# EAGLE design ArduinoInterface_v3 (EAGLE 9.2.1)
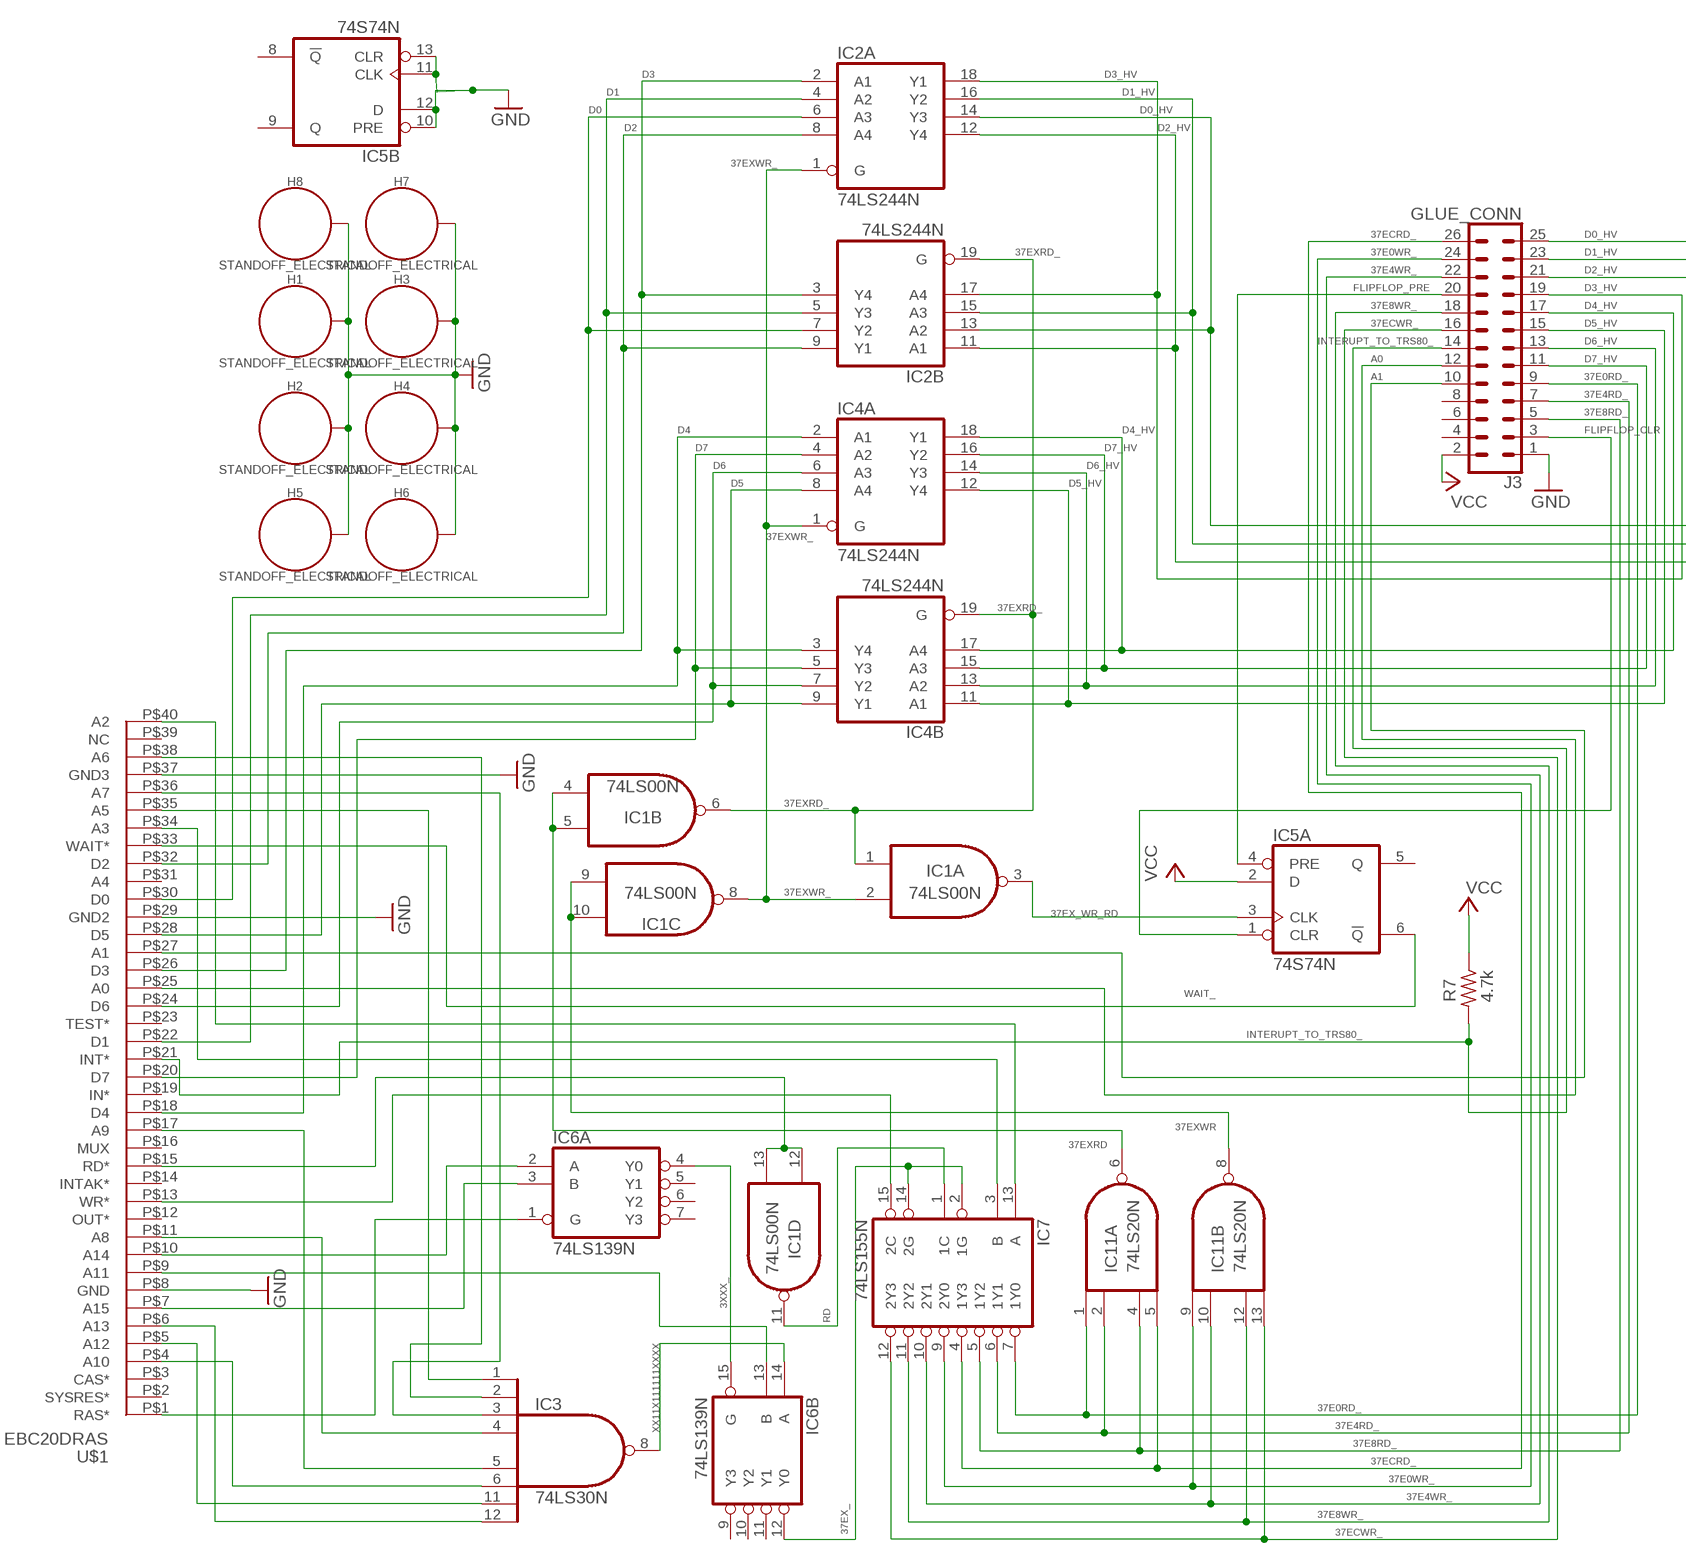
[diagram p0: schematic, sheet 1, part 1 of 2]
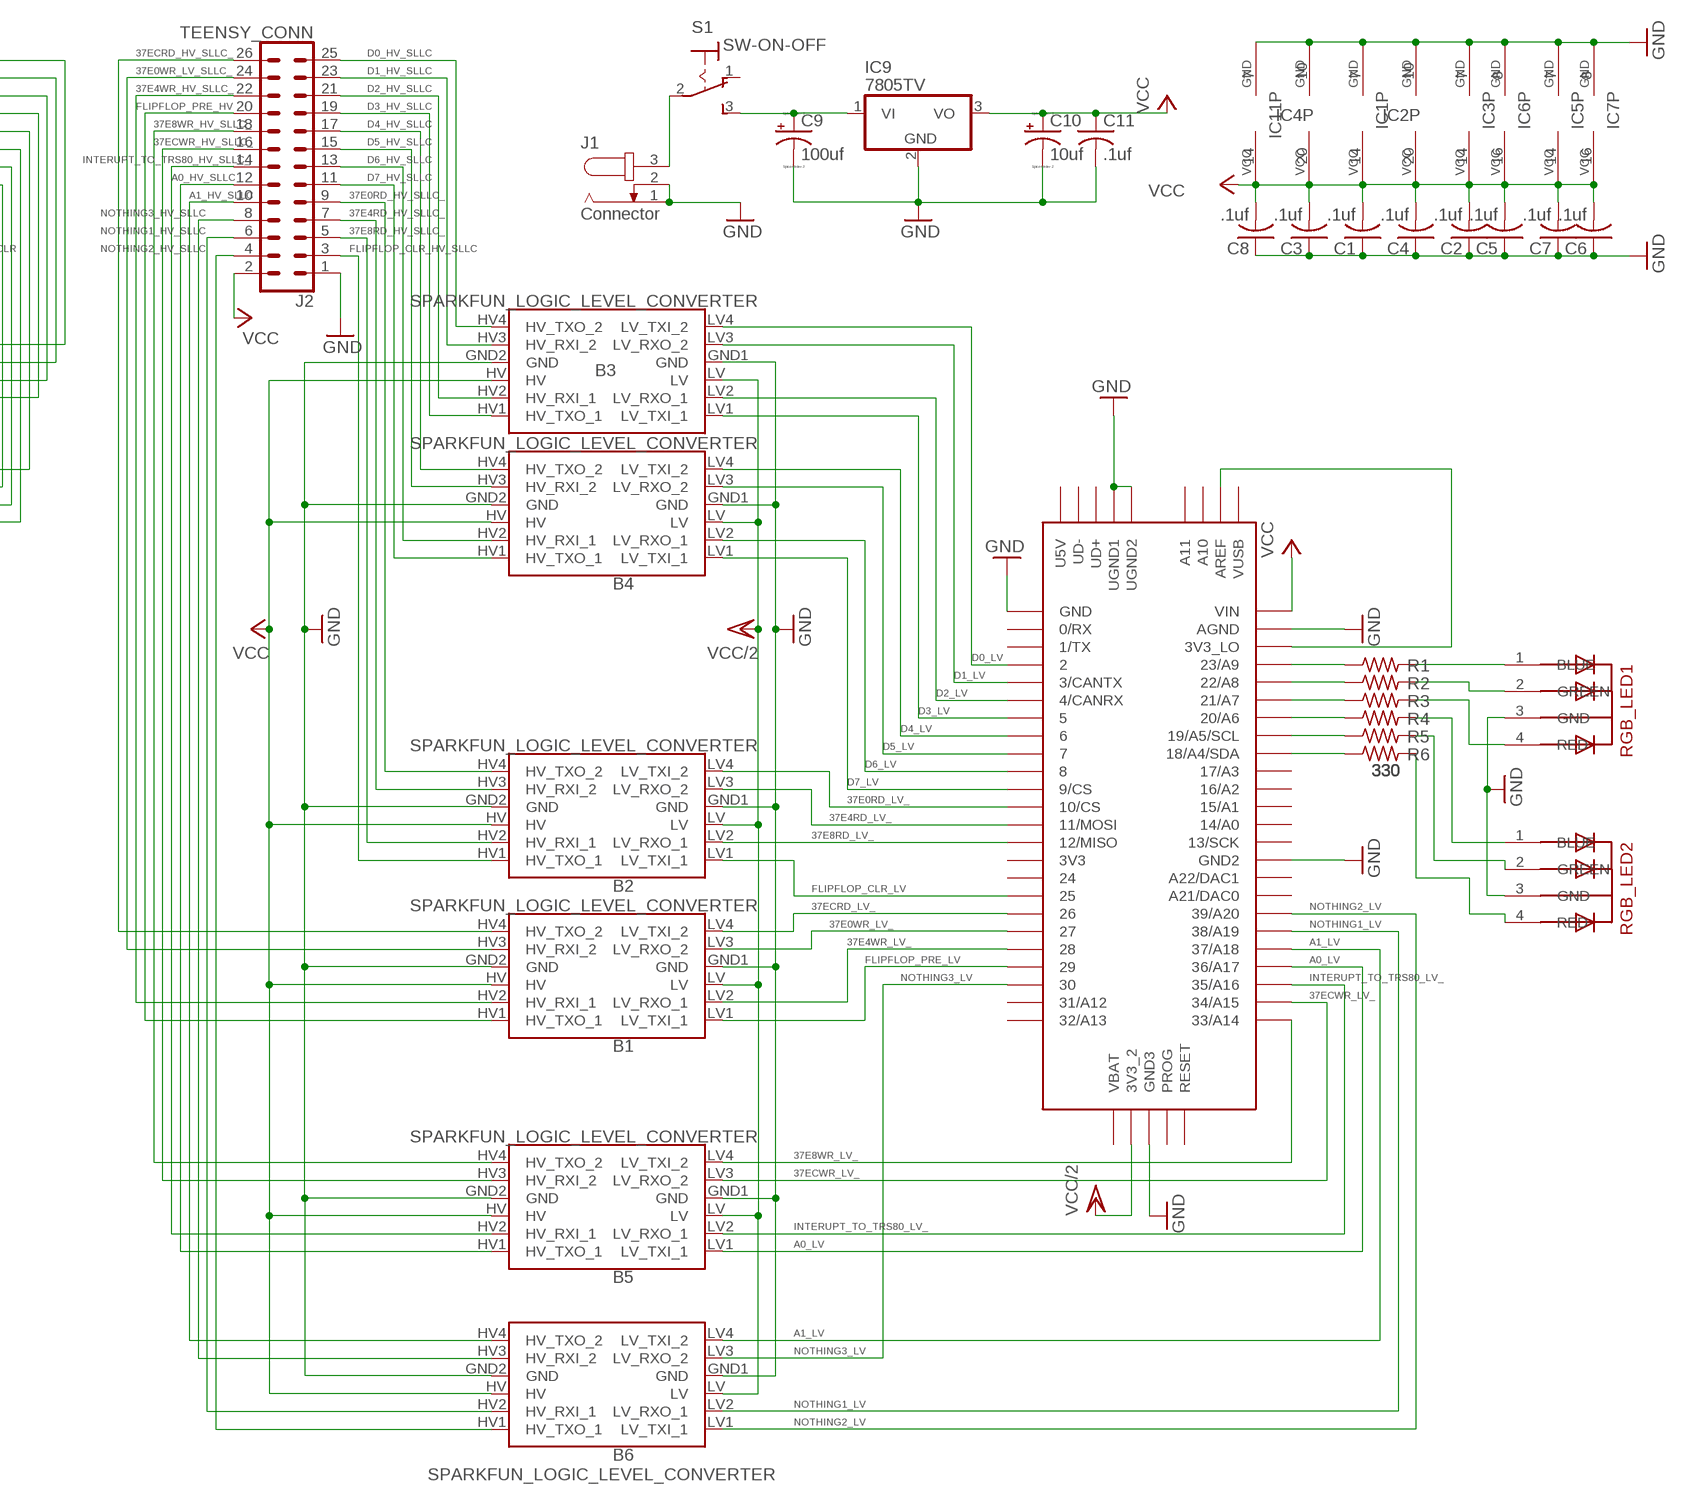
[diagram p1: schematic, sheet 1, part 2 of 2]

## Parts
B1  SPARKFUN_LOGIC_LEVEL_CONVERTER  [SPARKFUN_LOGIC_LEVEL_CONVERTER]
B2  SPARKFUN_LOGIC_LEVEL_CONVERTER  [SPARKFUN_LOGIC_LEVEL_CONVERTER]
B3  SPARKFUN_LOGIC_LEVEL_CONVERTER  [SPARKFUN_LOGIC_LEVEL_CONVERTER]
B4  SPARKFUN_LOGIC_LEVEL_CONVERTER  [SPARKFUN_LOGIC_LEVEL_CONVERTER]
B5  SPARKFUN_LOGIC_LEVEL_CONVERTER  [SPARKFUN_LOGIC_LEVEL_CONVERTER]
B6  SPARKFUN_LOGIC_LEVEL_CONVERTER  [SPARKFUN_LOGIC_LEVEL_CONVERTER]
C1  .1uf  C-US025-025X050  [C025-025X050]
C2  .1uf  C-US025-025X050  [C025-025X050]
C3  .1uf  C-US025-025X050  [C025-025X050]
C4  .1uf  C-US025-025X050  [C025-025X050]
C5  .1uf  C-US025-025X050  [C025-025X050]
C6  .1uf  C-US025-025X050  [C025-025X050]
C7  .1uf  C-US025-025X050  [C025-025X050]
C8  .1uf  C-US025-025X050  [C025-025X050]
C9  100uf  CPOL-USE5-6  [E5-6]
C10  10uf  CPOL-USE5-6  [E5-6]
C11  .1uf  C-US025-025X050  [C025-025X050]
H1  STANDOFF_ELECTRICAL  [STANDOFF-ELECTRICAL]
H2  STANDOFF_ELECTRICAL  [STANDOFF-ELECTRICAL]
H3  STANDOFF_ELECTRICAL  [STANDOFF-ELECTRICAL]
H4  STANDOFF_ELECTRICAL  [STANDOFF-ELECTRICAL]
H5  STANDOFF_ELECTRICAL  [STANDOFF-ELECTRICAL]
H6  STANDOFF_ELECTRICAL  [STANDOFF-ELECTRICAL]
H7  STANDOFF_ELECTRICAL  [STANDOFF-ELECTRICAL]
H8  STANDOFF_ELECTRICAL  [STANDOFF-ELECTRICAL]
IC1  74LS00N  [DIL14]
IC2  74LS244N  [DIL20]
IC3  74LS30N  [DIL14]
IC4  74LS244N  [DIL20]
IC5  74S74N  [DIL14]
IC6  74LS139N  [DIL16]
IC7  74LS155N  [DIL16]
IC9  7805TV  [TO220V]
IC11  74LS20N  [DIL14]
J1  Connector  JACK-PLUG0  [SPC4077]
J2  TEENSY_CONN  CONN_13X22X13  [2X13]
J3  GLUE_CONN  CONN_13X22X13  [2X13]
R1  330  R-US_0204/2V  [0204V]
R2  330  R-US_0204/2V  [0204V]
R3  330  R-US_0204/2V  [0204V]
R4  330  R-US_0204/2V  [0204V]
R5  330  R-US_0204/2V  [0204V]
R6  330  R-US_0204/2V  [0204V]
R7  4.7k  R-US_0204/2V  [0204V]
RGB_LED1  5MMRGBLED  [LED5MMRGB]
RGB_LED2  5MMRGBLED  [LED5MMRGB]
S1  SW-ON-OFF  M9040P  [M9040P]
U$1  EBC20DRAS  [EBC20DRAS]
U$2  TEENSY_3.5/3.6  [TEENSY_3.5/3.6]

## Nets
3XXX_: IC6.4(A:Y0) IC6.15(B:G)
9V: C9.+ IC9.1(VI) S1.3(S)
9V_TO_SW: J1.3 S1.2(P)
37E0RD_: IC7.7(1Y0) IC11.1(A:I0) J3.9
37E0RD_HV_SLLC_: B2.HV4(HV_TXO_2) J2.9
37E0RD_LV_: B2.LV4(LV_TXI_2) U$2.10/CS
37E0WR_: IC7.9(2Y0) IC11.9(B:I0) J3.24
37E0WR_LV_: B1.LV3(LV_RXO_2) U$2.27
37E0WR_LV_SLLC_: B1.HV3(HV_RXI_2) J2.24
37E4RD_: IC7.6(1Y1) IC11.2(A:I1) J3.7
37E4RD_HV_SLLC_: B2.HV3(HV_RXI_2) J2.7
37E4RD_LV_: B2.LV3(LV_RXO_2) U$2.11/MOSI
37E4WR_: IC7.10(2Y1) IC11.10(B:I1) J3.22
37E4WR_HV_SLLC_: B1.HV2(HV_RXI_1) J2.22
37E4WR_LV_: B1.LV2(LV_RXO_1) U$2.28
37E8RD_: IC7.5(1Y2) IC11.4(A:I2) J3.5
37E8RD_HV_SLLC_: B2.HV2(HV_RXI_1) J2.5
37E8RD_LV_: B2.LV2(LV_RXO_1) U$2.12/MISO
37E8WR_: IC7.11(2Y2) IC11.12(B:I2) J3.18
37E8WR_HV_SLLC_: B5.HV4(HV_TXO_2) J2.18
37E8WR_LV_: B5.LV4(LV_TXI_2) U$2.33/A14
37ECRD_: IC7.4(1Y3) IC11.5(A:I3) J3.26
37ECRD_HV_SLLC_: B1.HV4(HV_TXO_2) J2.26
37ECRD_LV_: B1.LV4(LV_TXI_2) U$2.26
37ECWR_: IC7.12(2Y3) IC11.13(B:I3) J3.16
37ECWR_HV_SLLC_: B5.HV3(HV_RXI_2) J2.16
37ECWR_LV_: B5.LV3(LV_RXO_2) U$2.34/A15
37EX_: IC6.12(B:Y0) IC7.2(1G) IC7.14(2G)
37EX_WR_RD: IC1.3(A:O) IC5.3(A:CLK)
37EXRD: IC1.4(B:I0) IC1.5(B:I1) IC11.6(A:O)
37EXRD_: IC1.1(A:I0) IC1.6(B:O) IC2.19(B:G) IC4.19(B:G)
37EXWR: IC1.9(C:I0) IC1.10(C:I1) IC11.8(B:O)
37EXWR_: IC1.2(A:I1) IC1.8(C:O) IC2.1(A:G) IC4.1(A:G)
A0: J3.12 U$1.P$25(A0)
A0_HV_SLLC: B5.HV1(HV_TXO_1) J2.12
A0_LV: B5.LV1(LV_TXI_1) U$2.36/A17
A1: J3.10 U$1.P$27(A1)
A1_HV_SLLC: B6.HV4(HV_TXO_2) J2.10
A1_LV: B6.LV4(LV_TXI_2) U$2.37/A18
A2: IC7.13(A) U$1.P$40(A2)
A3: IC7.3(B) U$1.P$34(A3)
A5: IC3.1(I0) U$1.P$35(A5)
A6: IC3.2(I1) U$1.P$38(A6)
A7: IC3.3(I2) U$1.P$36(A7)
A8: IC3.4(I3) U$1.P$11(A8)
A9: IC3.5(I4) U$1.P$17(A9)
A10: IC3.6(I5) U$1.P$4(A10)
A11: IC6.13(B:B) U$1.P$9(A11)
A12: IC3.11(I6) U$1.P$5(A12)
A13: IC3.12(I7) U$1.P$6(A13)
A14: IC6.2(A:A) U$1.P$10(A14)
A15: IC6.3(A:B) U$1.P$7(A15)
D0: IC2.6(A:A3) IC2.7(B:Y2) U$1.P$30(D0)
D0_HV: IC2.13(B:A2) IC2.14(A:Y3) J3.25
D0_HV_SLLC: B3.HV4(HV_TXO_2) J2.25
D0_LV: B3.LV4(LV_TXI_2) U$2.2
D1: IC2.4(A:A2) IC2.5(B:Y3) U$1.P$22(D1)
D1_HV: IC2.15(B:A3) IC2.16(A:Y2) J3.23
D1_HV_SLLC: B3.HV3(HV_RXI_2) J2.23
D1_LV: B3.LV3(LV_RXO_2) U$2.3/CANTX
D2: IC2.8(A:A4) IC2.9(B:Y1) U$1.P$32(D2)
D2_HV: IC2.11(B:A1) IC2.12(A:Y4) J3.21
D2_HV_SLLC: B3.HV2(HV_RXI_1) J2.21
D2_LV: B3.LV2(LV_RXO_1) U$2.4/CANRX
D3: IC2.2(A:A1) IC2.3(B:Y4) U$1.P$26(D3)
D3_HV: IC2.17(B:A4) IC2.18(A:Y1) J3.19
D3_HV_SLLC: B3.HV1(HV_TXO_1) J2.19
D3_LV: B3.LV1(LV_TXI_1) U$2.5
D4: IC4.2(A:A1) IC4.3(B:Y4) U$1.P$18(D4)
D4_HV: IC4.17(B:A4) IC4.18(A:Y1) J3.17
D4_HV_SLLC: B4.HV4(HV_TXO_2) J2.17
D4_LV: B4.LV4(LV_TXI_2) U$2.6
D5: IC4.8(A:A4) IC4.9(B:Y1) U$1.P$28(D5)
D5_HV: IC4.11(B:A1) IC4.12(A:Y4) J3.15
D5_HV_SLLC: B4.HV3(HV_RXI_2) J2.15
D5_LV: B4.LV3(LV_RXO_2) U$2.7
D6: IC4.6(A:A3) IC4.7(B:Y2) U$1.P$24(D6)
D6_HV: IC4.13(B:A2) IC4.14(A:Y3) J3.13
D6_HV_SLLC: B4.HV2(HV_RXI_1) J2.13
D6_LV: B4.LV2(LV_RXO_1) U$2.8
D7: IC4.4(A:A2) IC4.5(B:Y3) U$1.P$20(D7)
D7_HV: IC4.15(B:A3) IC4.16(A:Y2) J3.11
D7_HV_SLLC: B4.HV1(HV_TXO_1) J2.11
D7_LV: B4.LV1(LV_TXI_1) U$2.9/CS
FLIPFLOP_CLR: IC5.1(A:CLR) J3.3
FLIPFLOP_CLR_HV_SLLC: B2.HV1(HV_TXO_1) J2.3
FLIPFLOP_CLR_LV: B2.LV1(LV_TXI_1) U$2.25
FLIPFLOP_PRE: IC5.4(A:PRE) J3.20
FLIPFLOP_PRE_HV: B1.HV1(HV_TXO_1) J2.20
FLIPFLOP_PRE_LV: B1.LV1(LV_TXI_1) U$2.29
GND: B1.GND1(GND) B1.GND2(GND) B2.GND1(GND) B2.GND2(GND) B3.GND1(GND) B3.GND2(GND) B4.GND1(GND) B4.GND2(GND) B5.GND1(GND) B5.GND2(GND) B6.GND1(GND) B6.GND2(GND) C1.1 C2.1 C3.1 C4.1 C5.1 C6.1 C7.1 C8.1 C9.- C10.- C11.2 H1.P1 H2.P1 H3.P1 H4.P1 H5.P1 H6.P1 H7.P1 H8.P1 IC1.7(P:GND) IC2.10(P:GND) IC3.7(GND) IC4.10(P:GND) IC5.7(P:GND) IC5.10(B:PRE) IC5.11(B:CLK) IC5.12(B:D) IC5.13(B:CLR) IC6.8(P:GND) IC7.8(GND) IC9.2(GND) IC11.7(P:GND) J1.1 J1.2 J2.1 J3.1 RGB_LED1.3(GND) RGB_LED2.3(GND) U$1.P$8(GND) U$1.P$29(GND2) U$1.P$37(GND3) U$2.AGND U$2.GND U$2.GND2 U$2.GND3 U$2.UGND1 U$2.UGND2
INTERUPT_TO_TRS80_: J3.14 R7.2 U$1.P$21(INT*)
INTERUPT_TO_TRS80_HV_SLLC_: B5.HV2(HV_RXI_1) J2.14
INTERUPT_TO_TRS80_LV_: B5.LV2(LV_RXO_1) U$2.35/A16
N$1: U$2.3V3_LO U$2.AREF
N$5: R1.1 U$2.23/A9
N$6: R2.1 U$2.22/A8
N$9: R3.1 U$2.21/A7
N$10: R1.2 RGB_LED1.1(BLUE)
N$14: R2.2 RGB_LED1.2(GREEN)
N$15: R3.2 RGB_LED1.4(RED)
N$16: R4.1 U$2.20/A6
N$17: R5.1 U$2.19/A5/SCL
N$18: R6.1 U$2.18/A4/SDA
N$19: R4.2 RGB_LED2.1(BLUE)
N$20: R5.2 RGB_LED2.2(GREEN)
N$21: R6.2 RGB_LED2.4(RED)
NOTHING1_HV_SLLC: B6.HV2(HV_RXI_1) J2.6
NOTHING1_LV: B6.LV2(LV_RXO_1) U$2.38/A19
NOTHING2_HV_SLLC: B6.HV1(HV_TXO_1) J2.4
NOTHING2_LV: B6.LV1(LV_TXI_1) U$2.39/A20
NOTHING3_HV_SLLC: B6.HV3(HV_RXI_2) J2.8
NOTHING3_LV: B6.LV3(LV_RXO_2) U$2.30
RAS_: IC6.1(A:G) U$1.P$1(RAS*)
RD: IC1.11(D:O) IC7.1(1C)
RD_: IC1.12(D:I0) IC1.13(D:I1) U$1.P$15(RD*)
VCC: B1.HV B2.HV B3.HV B4.HV B5.HV B6.HV C1.2 C2.2 C3.2 C4.2 C5.2 C6.2 C7.2 C8.2 C10.+ C11.1 IC1.14(P:VCC) IC2.20(P:VCC) IC3.14(VCC) IC4.20(P:VCC) IC5.2(A:D) IC5.14(P:VCC) IC6.16(P:VCC) IC7.16(VCC) IC9.3(VO) IC11.14(P:VCC) J2.2 J3.2 R7.1 U$2.VIN
VCC/2: B1.LV B2.LV B3.LV B4.LV B5.LV B6.LV U$2.3V3_2
WAIT_: IC5.6(A:!Q) U$1.P$33(WAIT*)
WR_: IC7.15(2C) U$1.P$13(WR*)
XX11X111111XXXX: IC3.8(O) IC6.14(B:A)
Unconnected: IC5.5(A:Q) IC5.8(B:!Q) IC5.9(B:Q) IC6.5(A:Y1) IC6.6(A:Y2) IC6.7(A:Y3) IC6.9(B:Y3) IC6.10(B:Y2) IC6.11(B:Y1) J3.4 J3.6 J3.8 S1.1(O) U$1.P$2(SYSRES*) U$1.P$3(CAS*) U$1.P$12(OUT*) U$1.P$14(INTAK*) U$1.P$16(MUX) U$1.P$19(IN*) U$1.P$23(TEST*) U$1.P$31(A4) U$1.P$39(NC) U$2.0/RX U$2.1/TX U$2.3V3 U$2.13/SCK U$2.14/A0 U$2.15/A1 U$2.16/A2 U$2.17/A3 U$2.21/DAC0(A21/DAC0) U$2.24 U$2.31/A12 U$2.32/A13 U$2.A10 U$2.A11 U$2.A22/DAC1 U$2.PROG U$2.RESET U$2.U5V U$2.UD+ U$2.UD- U$2.VBAT U$2.VUSB

## Library data of the parts
B1-B6 = SparkFun-Boards:SPARKFUN_LOGIC_LEVEL_CONVERTER: SparkFun Logic Level Converter -Bi-Directional This is the mechnical outline for the 3.3V - 5V bi directional logic level converter. *Note, the "LOCK" Package has the header pins staggered by an offset of 5 mils (off center line), so that when you slide a row of standard 0.1" headers into the PTH pads, it will hold position vertically. See the follwing turorial for more information on this type of special footprints: Sneaky Footprints <https://www.sparkfun.com/tutorials/114> SparkFun Products: SparkFun Logic Level Converter - Bi-Directional <https://www.sparkfun.com/products/12009>
C1-C8 C11 = adafruit:C-US: CAPACITOR, American symbol
C9 C10 = resistor:CPOL-US: POLARIZED CAPACITOR, American symbol
H1-H8 = SparkFun-Hardware:STANDOFF_ELECTRICAL: Stand Off Drill holes with an electrical connection. For example, use these to ground your board to a chassis. Example SparkFun Products Screw - Phillips Head (1/4", 4-40, 10 pack) <https://www.sparkfun.com/products/10453> (PRT-10453) Screw - Phillips Head (1/2", 4-40, 10 pack) <https://www.sparkfun.com/products/10452> (PRT-10452) Screw - Phillips Head (3/4", 4-40, 10 pack) <https://www.sparkfun.com/products/10451> (PRT-10451) Screw - Phillips Head (1", 4-40, 10 pack) <https://www.sparkfun.com/products/10450> (PRT-10450)
IC1 = 74xx-us:74*00: Quad 2-input NAND gate
IC2 IC4 = 74xx-us:74*244: Octal BUFFER and LINE DRIVER, 3-state
IC3 = 74xx-us:74*30: 8-input NAND gate
IC5 = 74xx-us:74*74: Dual D type positive edge triggered FLIP FLOP, preset and clear
IC6 = 74xx-us:74*139: Dual 2-line to 4-line DECODER/DEMULTIPLEXER
IC7 = 74xx-us:74*155: Dual 2-line to 4-line data DECODER/DEMULTIPLEXER
IC9 = linear:78*: Positive VOLTAGE REGULATOR Source: http://cache.national.com/ds/LM/LM78L05.pdf http://www.fairchildsemi.com/ds/LM/LM7805.pdf
IC11 = 74xx-us:74*20: Dual 4-input NAND gate
J1 = con-jack:JACK-PLUG: DC POWER JACK Power Jack, DC, Right Angle, Through Hole, Rated 5A at 16VDC, PC Terminals Distributor: Farnell (www.Farnell.de) Drawing: 84N1161.pdf / 84N1162.pdf Manufacturer: SPC Technology (www.spctechnology.com) Type: SPC4077 / SPC 4078; OC_FARNELL: unknown; OC_NEWARK: unknown
J2 J3 = SparkFun-Connectors:CONN_13X2: Multi connection point. Often used as Generic Header-pin footprint for 0.1 inch spaced/style header connections On any of the 0.1 inch spaced packages, you can populate with these: Break Away Headers - Straight <https://www.sparkfun.com/products/116> (PRT-00116) Break Away Male Headers - Right Angle <https://www.sparkfun.com/products/553> (PRT-00553) Female Headers <https://www.sparkfun.com/products/115> (PRT-00115) Break Away Headers - Machine Pin <https://www.sparkfun.com/products/117> (PRT-00117) Break Away Female Headers - Swiss Machine Pin <https://www.sparkfun.com/products/743> (PRT-00743)
R1-R7 = resistor:R-US_: RESISTOR, American symbol
RGB_LED1 RGB_LED2 = adafruit:5MMRGBLED
S1 = switch:M9040P: TOGGLE SWITCH Marquardt
U$1 = TMS99:EBC20DRAS
U$2 = Teensy356:TEENSY_3.5/3.6

## Net classes
0 default: width 0.3 mm, clearance 0.05 mm

## Board
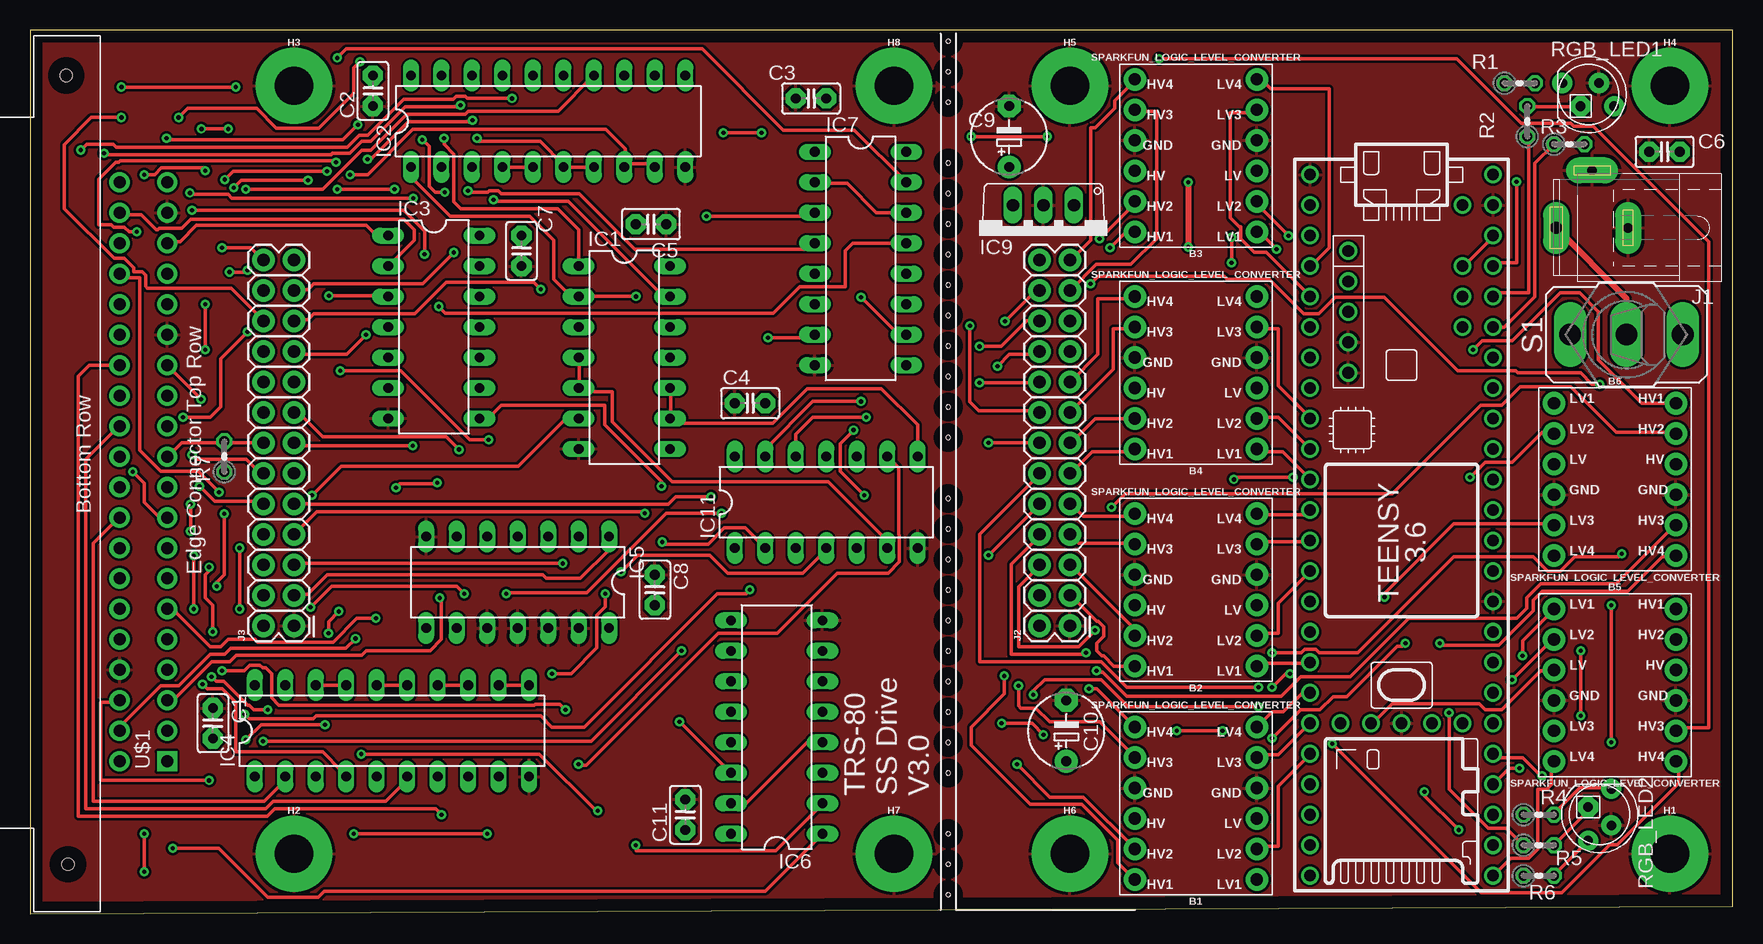
[diagram p2: board, top side]
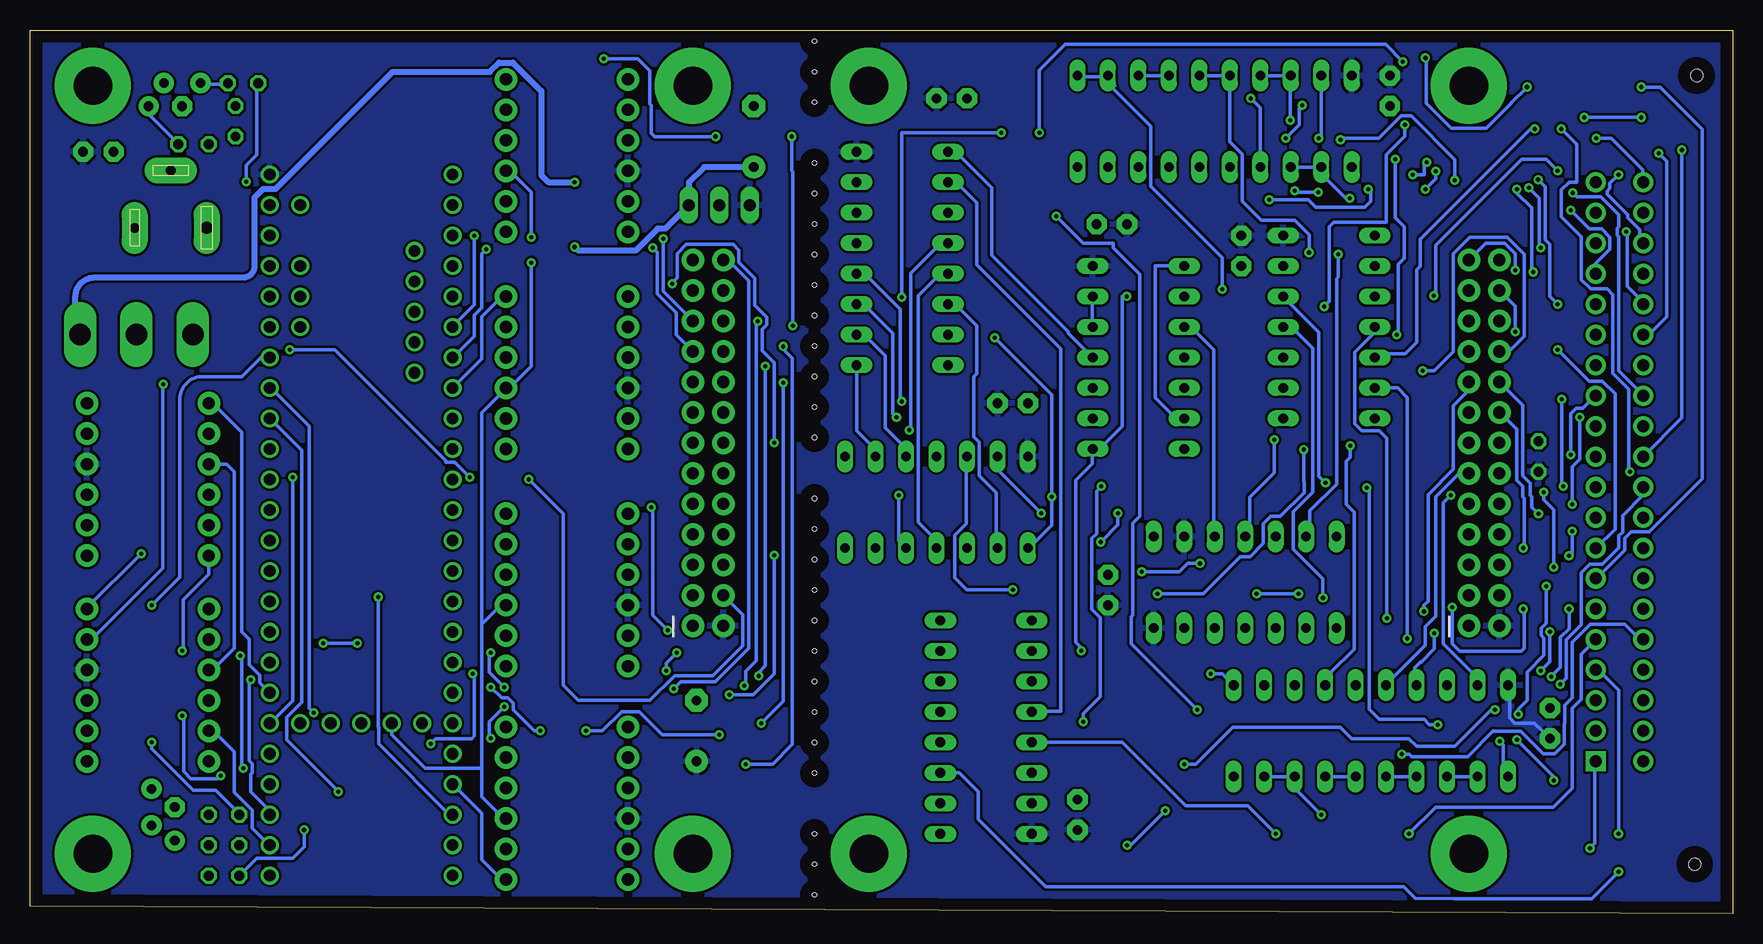
[diagram p3: board, bottom side, seen from below]

Size 141.9 x 73.65 mm. Coordinates in mm from the lower left corner, seen from the top.
Outline: 0,0 141.9,0.64 141.9,73.65 0,73.65 0,0
Copper layers (1*16): Top 0.035mm / dielectric 1.5mm / Bottom 0.035mm
Design rules "default": minimum track width 0.2mm, minimum drill 0.35mm, track to track 8mil, track to pad 8mil, pad to pad 8mil, via to via 8mil, smd to smd 8mil, copper to edge 40mil, drill to drill 6mil, minimum pad ring 10mil, minimum via ring 8mil, stop-mask expansion 4mil, vias tented up to drill 0mil, thermal gap 10mil
Holes 0.35 mm at 76.52,72.71 76.52,70.17 76.52,67.63 76.52,62.55 76.52,60.01 76.52,57.47 76.52,52.39 76.52,49.85 76.52,47.31 76.52,42.23 76.52,39.69 76.52,32.07 76.52,29.53 76.52,26.99 76.52,21.91 76.52,19.37 76.52,16.83 76.52,11.75 76.52,6.67 76.52,1.59 76.52,14.29 76.52,24.45 76.52,34.61 76.52,44.77 76.52,54.93 76.52,4.13

### Footprints (pad centres in the part's own frame; a part is rotated, then mirrored left to right if it is on the bottom)
SPARKFUN_LOGIC_LEVEL_CONVERTER = drill 1.016 pad 1.88: GND1 -5.08,-1.27; GND2 5.08,-1.27; HV 5.08,1.27; HV1 5.08,6.35; HV2 5.08,3.81; HV3 5.08,-3.81; HV4 5.08,-6.35; LV -5.08,1.27; LV1 -5.08,6.35; LV2 -5.08,3.81; LV3 -5.08,-3.81; LV4 -5.08,-6.35
C025-025X050 = drill 0.813 pad 1.676 octagon: 1 -1.27,0; 2 1.27,0
E5-6 = drill 0.813 pad 1.905: + -2.54,0 | drill 0.813 pad 1.905 octagon: - 2.54,0
STANDOFF-ELECTRICAL = drill 3.2 pad 6.35: P1 0,0
DIL14 = drill 0.813 long: 1 -7.62,-3.81; 2 -5.08,-3.81; 3 -2.54,-3.81; 4 0,-3.81; 5 2.54,-3.81; 6 5.08,-3.81; 7 7.62,-3.81; 8 7.62,3.81; 9 5.08,3.81; 10 2.54,3.81; 11 0,3.81; 12 -2.54,3.81; 13 -5.08,3.81; 14 -7.62,3.81
DIL20 = drill 0.813 long: 1 -11.43,-3.81; 2 -8.89,-3.81; 3 -6.35,-3.81; 4 -3.81,-3.81; 5 -1.27,-3.81; 6 1.27,-3.81; 7 3.81,-3.81; 8 6.35,-3.81; 9 8.89,-3.81; 10 11.43,-3.81; 11 11.43,3.81; 12 8.89,3.81; 13 6.35,3.81; 14 3.81,3.81; 15 1.27,3.81; 16 -1.27,3.81; 17 -3.81,3.81; 18 -6.35,3.81; 19 -8.89,3.81; 20 -11.43,3.81
DIL16 = drill 0.813 long: 1 -8.89,-3.81; 2 -6.35,-3.81; 3 -3.81,-3.81; 4 -1.27,-3.81; 5 1.27,-3.81; 6 3.81,-3.81; 7 6.35,-3.81; 8 8.89,-3.81; 9 8.89,3.81; 10 6.35,3.81; 11 3.81,3.81; 12 1.27,3.81; 13 -1.27,3.81; 14 -3.81,3.81; 15 -6.35,3.81; 16 -8.89,3.81
TO220V = drill 1.016 long: 1 -2.54,-2.54; 2 0,-2.54; 3 2.54,-2.54
SPC4077 = drill 0.8 pad 2.184 long: 1 -3,0; 2 0,-4.8 | drill 1 pad 2.184 long: 3 3,0
2X13 = drill 1.016 pad 1.88: 1 0,0; 2 0,2.54; 3 2.54,0; 4 2.54,2.54; 5 5.08,0; 6 5.08,2.54; 7 7.62,0; 8 7.62,2.54; 9 10.16,0; 10 10.16,2.54; 11 12.7,0; 12 12.7,2.54; 13 15.24,0; 14 15.24,2.54; 15 17.78,0; 16 17.78,2.54; 17 20.32,0; 18 20.32,2.54; 19 22.86,0; 20 22.86,2.54; 21 25.4,0; 22 25.4,2.54; 23 27.94,0; 24 27.94,2.54; 25 30.48,0; 26 30.48,2.54
0204V = drill 0.813 octagon: 1 -1.27,0; 2 1.27,0
LED5MMRGB = drill 0.8 pad 1.676: 1 -2.159,0.968; 3 0.889,0.968; 4 2.159,-0.968 | drill 0.8 pad 1.676 octagon: 2 -0.635,-0.968
M9040P = drill 1.803 long: 1 0,4.699; 2 0,0; 3 0,-4.699
EBC20DRAS = drill 1 pad 1.676 square: P$1 0,0 | drill 1 pad 1.676: P$2 0,3.969; P$3 2.54,0; P$4 2.54,3.969; P$5 5.08,0; P$6 5.08,3.969; P$7 7.62,0; P$8 7.62,3.969; P$9 10.16,0; P$10 10.16,3.969; P$11 12.7,0; P$12 12.7,3.969; P$13 15.24,0; P$14 15.24,3.969; P$15 17.78,0; P$16 17.78,3.969; P$17 20.32,0; P$18 20.32,3.969; P$19 22.86,0; P$20 22.86,3.969; P$21 25.4,0; P$22 25.4,3.969; P$23 27.94,0; P$24 27.94,3.969; P$25 30.48,0; P$26 30.48,3.969; P$27 33.02,0; P$28 33.02,3.969; P$29 35.56,0; P$30 35.56,3.969; P$31 38.1,0; P$32 38.1,3.969; P$33 40.64,0; P$34 40.64,3.969; P$35 43.18,0; P$36 43.18,3.969; P$37 45.72,0; P$38 45.72,3.969; P$39 48.26,0; P$40 48.26,3.969 | hole 1: -8.572,8.255; 57.15,8.414
TEENSY_3.5/3.6 = drill 0.965: 0/RX -25.4,-7.62; 1/TX -22.86,-7.62; 2 -20.32,-7.62; 3/CANTX -17.78,-7.62; 3V3 7.62,-7.62; 3V3_2 17.78,-2.54; 3V3_LO -22.86,7.62; 4/CANRX -15.24,-7.62; 5 -12.7,-7.62; 6 -10.16,-7.62; 7 -7.62,-7.62; 8 -5.08,-7.62; 9/CS -2.54,-7.62; 10/CS 0,-7.62; 11/MOSI 2.54,-7.62; 12/MISO 5.08,-7.62; 13/SCK 5.08,7.62; 14/A0 2.54,7.62; 15/A1 0,7.62; 16/A2 -2.54,7.62; 17/A3 -5.08,7.62; 18/A4/SDA -7.62,7.62; 19/A5/SCL -10.16,7.62; 20/A6 -12.7,7.62; 21/A7 -15.24,7.62; 21/DAC0 12.7,7.62; 22/A8 -17.78,7.62; 23/A9 -20.32,7.62; 24 10.16,-7.62; 25 12.7,-7.62; 26 15.24,-7.62; 27 17.78,-7.62; 28 20.32,-7.62; 29 22.86,-7.62; 30 25.4,-7.62; 31/A12 27.94,-7.62; 32/A13 30.48,-7.62; 33/A14 30.48,7.62; 34/A15 27.94,7.62; 35/A16 25.4,7.62; 36/A17 22.86,7.62; 37/A18 20.32,7.62; 38/A19 17.78,7.62; 39/A20 15.24,7.62; A10 -17.78,5.08; A11 -15.24,5.08; A22/DAC1 10.16,7.62; AGND -25.4,7.62; AREF -20.32,5.08; GND -27.94,-7.62; GND2 7.62,7.62; GND3 17.78,0; PROG 17.78,2.54; RESET 17.78,5.08; U5V -21.59,-4.445; UD+ -16.51,-4.445; UD- -19.05,-4.445; UGND1 -13.97,-4.445; UGND2 -11.43,-4.445; VBAT 17.78,-5.08; VIN -27.94,7.62; VUSB -25.4,5.08

### Placement (x,y rotation side)
B1  97.16,9.21 180 top
B2  97.16,26.99 180 top
B3  97.16,63.18 180 top
B4  97.16,45.09 180 top
B5  132.08,19.05 0 top
B6  132.08,36.2 0 top
C1  15.24,15.88 270 top
C2  28.57,68.58 90 top
C3  65.09,67.94 0 top
C4  60.01,42.55 0 top
C5  51.75,57.47 180 top
C6  136.21,63.5 0 top
C7  40.96,55.24 90 top
C8  52.07,26.99 270 top
C9  81.6,64.77 90 top
C10  86.36,15.24 90 top
C11  54.61,8.26 90 top
H1  136.66,5 0 top
H2  22,5 0 top
H3  22,69 0 top
H4  136.66,69 0 top
H5  86.67,69 0 top
H6  86.67,5 0 top
H7  72,5 0 top
H8  72,69 0 top
IC1  49.53,46.35 270 top
IC2  43.18,66.04 0 top
IC3  33.66,48.9 270 top
IC4  30.16,15.24 0 top
IC5  40.64,27.62 180 top
IC6  62.23,15.56 90 top
IC7  69.22,54.61 270 top
IC9  84.45,56.52 180 top
IC11  66.36,34.29 0 top
J1  130.18,57.15 180 top
J2  86.67,24 90 top
J3  22,24 90 top
R1  124.14,69.22 0 top
R2  124.78,66.04 90 top
R3  128.27,64.14 0 top
R4  125.73,8.26 0 top
R5  125.73,5.71 0 top
R6  125.73,3.17 0 top
R7  16.19,38.1 90 top
RGB_LED1  129.86,68.26 0 top
RGB_LED2  130.81,8.26 270 top
S1  133.03,48.26 90 top
U$1  11.43,12.7 90 top
U$2  114.3,33.66 270 top

### Tracks (layer width: path | path; a pad name or v marks a point on that pad's centre or on a via)
3XXX_
  Top 0.3: IC6.4 66,14.25 65.96,14.29 64.77,14.29 59.69,9.21 IC6.15
9V  (via drill 0.35)
  Top 0.508: v96.52,60.96 v96.52,55.56
  Bottom 0.508: C9.+ 85.72,62.23 87,60.96 IC9.1 88.97,57.09 89.6,57.09 91.43,55.26 96.19,55.26 96.5,55.56 v96.52,55.56 | S1.3 arc90 138.11,48.64 138.11,51.44 arc90 136.53,53.02 124.14,53.02 arc-90 123.19,53.98 123.19,59.69 122.48,60.4 121.43,60.4 111.66,70.17 103.58,70.17 102.81,70.93 101.66,70.93 99.29,68.56 99.29,61.53 98.72,60.96 v96.52,60.96
9V_TO_SW
  Top 0.508: J1.3 133.03,51.29 S1.2
37E0RD_  (via drill 0.35)
  Top 0.3: v61.5,48 64.12,48 64.38,48.25 65.38,48.25 IC7.7 | J3.9 23.18,34.16 23.2,34.14 53.19,34.14 53.81,34.76 v56.75,34.76
  Bottom 0.3: v61.5,48 56.75,43.25 v56.75,34.76 56.75,32.38 58.62,30.5 IC11.1
37E0RD_HV_SLLC_
  Top 0.3: J2.9 86.75,34.12 87.75,33.12 91.88,33.12 92,33.25 B2.HV4
37E0RD_LV_
  Top 0.3: U$2.10/CS 106.62,33.62 106.25,33.25 102.25,33.25 B2.LV4
37E0WR_  (via drill 0.35)
  Top 0.3: v12.75,41.38 15,41.38 15.88,42.25 15.88,46.25 v18.12,48.5 | v13.38,31.88 v13.38,34.12 | v15.12,19.75 15.5,19.38 16.12,19.38 18.12,17.38 18.25,17.38 18.62,17 v19.82,17 | v13.65,25.4 v13.65,29.84 | v45.71,12.47 45.8,12.38 46.35,12.38 57.35,23.38 62.25,23.38 67.25,28.38 71.5,28.38 72.45,29.33 72.45,31.56 72.39,31.62 72.39,37.15 IC11.9
  Bottom 0.3: IC11.9 71.44,38.38 71.56,38.5 71.56,38.81 73,40.25 73,45.62 IC7.9 | v18.12,48.5 18.12,50.62 19.38,51.88 J3.24 | v12.75,41.38 12.75,37.88 13.38,37.25 v13.38,34.12 | v19.82,17 20.14,17 23.16,13.97 26.35,13.97 26.99,14.61 31.75,14.61 32.7,15.56 41.67,15.56 44.76,12.47 v45.71,12.47 | v15.12,19.75 15.12,19.8 14.38,20.54 14.38,23.04 13.65,23.77 v13.65,25.4 | v13.65,29.84 13.38,30.12 v13.38,31.88
37E0WR_LV_
  Top 0.3: U$2.27 106.62,15.88 104,13.25 103.12,13.25 103,13.12 102.25,13.12 B1.LV3
37E0WR_LV_SLLC_  (via drill 0.35)
  Top 0.3: v81.25,49.38 83.75,51.88 84.12,51.88 J2.24 | B1.HV3 92,13.12 89.12,16 84.97,16 83.82,17.14 82.55,17.14 82.38,17.32 v82.38,19
  Bottom 0.3: v82.38,19 82.25,19.12 82.25,20.22 81.38,21.09 81.38,49.25 v81.25,49.38
37E4RD_  (via drill 0.35)
  Top 0.3: v51.24,33.38 51.12,33.5 23.88,33.5 J3.7 | IC11.2 59.6,32.15 57.87,32.15 56.52,30.8 52.87,30.8 v52.68,30.98
  Bottom 0.3: IC11.2 61.38,30.5 61.38,35.08 62.8,36.51 62.8,39.3 63.25,39.75 63.25,44.75 63,45 63,49 64.75,50.75 65.38,50.75 IC7.6 | v51.24,33.38 51.24,32.42 v52.68,30.98
37E4RD_HV_SLLC_
  Top 0.3: J2.7 86.75,31.5 87.38,30.88 92,30.88 B2.HV3
37E4RD_LV_
  Top 0.3: U$2.11/MOSI 106.62,31 102.38,31 102.25,30.88 B2.LV3
37E4WR_  (via drill 0.35)
  Top 0.3: v69.25,51.38 72.25,48.38 73,48.38 IC7.10 | J3.22 19.38,49.5 16.75,52.12 9.79,52.12 9.63,52.28 9.63,53.21 9.33,53.5 8.65,53.5 8.65,53.83 7.86,54.62 7,54.62 2.85,58.77 2.85,64.11 5.11,66.36 v7.62,66.36 | v27.5,71 26.99,70.49 26.99,68.36 24.08,65.45 24.06,65.47 20.54,65.47 18.88,67.14 13.16,67.14 v12.38,66.36 | v57.78,65.09 v60.96,65.09
  Bottom 0.3: IC11.10 69,38.12 69.06,38.18 69.06,38.93 70.62,40.5 70.62,46.5 72.38,48.25 73,48.25 IC7.10 | v69.25,51.38 69.25,65.09 v60.96,65.09 | v7.62,66.36 v12.38,66.36 | v27.5,71 28.94,72.44 55.65,72.44 57.78,70.31 v57.78,65.09
37E4WR_HV_SLLC_  (via drill 0.35)
  Top 0.3: v82.25,12.47 84.99,9.73 87.77,9.73 92,5.5 B1.HV2 | v79.12,47.28 80.94,47.28 83.06,49.4 J2.22
  Bottom 0.3: v82.25,12.47 80.03,12.47 78.38,14.12 78.38,46.31 79.12,47.06 v79.12,47.28
37E4WR_LV_
  Top 0.3: U$2.28 106.62,13.25 104,10.62 104,5.62 103.12,5.62 103,5.5 102.25,5.5 B1.LV2
37E8RD_  (via drill 0.35)
  Top 0.3: v44.4,29.19 22.11,29.19 J3.5 | v49.25,28.5 50.62,29.88 56.62,29.88 58.12,28.38 64.38,28.38 66.38,30.38 IC11.4
  Bottom 0.3: IC11.4 66.38,30.5 66.43,30.56 66.43,31.18 67.88,32.62 67.88,51.5 66.12,53.25 65.5,53.25 IC7.5 | v49.25,28.5 46.11,28.5 45.42,29.19 v44.4,29.19
37E8RD_HV_SLLC_
  Top 0.3: J2.5 86.75,29 92,23.75 92,23.25 B2.HV2
37E8RD_LV_
  Top 0.3: U$2.12/MISO 106.62,28.5 104,25.88 104,23.38 102.38,23.38 102.25,23.25 B2.LV2
37E8WR_  (via drill 0.35)
  Top 0.3: IC11.12 63.82,39.97 65.22,41.38 v69.69,41.38 | v17.88,16.62 18.25,16.25 18.27,16.27 23.61,16.27 23.85,16.51 42.55,16.51 43.5,15.56 46.17,15.56 57.29,26.67 59.67,26.67 v59.99,26.99 | v15.56,27.3 15.56,27.62 16.19,28.26 v16.19,33.34
  Bottom 0.3: v69.69,41.38 70,41.68 70,48.38 72.38,50.75 73,50.75 IC7.11 | IC11.12 63.88,38 63.88,32.52 64.83,31.56 64.83,28 63.82,26.99 v59.99,26.99 | v16.19,33.34 16.75,33.9 16.75,34.75 16.88,34.88 16.88,35.88 17.5,36.5 17.5,42.36 J3.18 | v15.56,27.3 15.56,24.21 15.97,23.8 15.97,23.19 15.74,22.96 15.74,21.54 17.14,20.14 17.14,17.78 17.88,17.05 v17.88,16.62
37E8WR_HV_SLLC_  (via drill 0.35)
  Top 0.3: v79.12,44.25 84.12,44.25 J2.18 | v103.5,18.88 104.62,20 v105,20 | B5.HV4 137.25,12.62 137.38,12.62 137.38,10.88 132.25,5.75 131.62,5.75 127.62,1.75 120.93,1.75 v108.51,14.17 | v80.96,15.88 83.5,15.88 v84.45,14.92 | v95.57,15.24 v99.38,15.24
  Bottom 0.3: v105,20 104.88,19.88 104.88,14.82 105.09,14.61 108.08,14.61 v108.51,14.17 | v80.96,15.88 79.12,17.71 v79.12,44.25 | v103.5,18.88 102.61,17.98 102.07,17.98 101.64,17.55 101.64,17.02 99.86,15.24 v99.38,15.24 | v84.45,14.92 89.22,14.92 91.14,16.85 92.61,16.85 94.22,15.24 v95.57,15.24
37E8WR_LV_
  Top 0.3: U$2.33/A14 122,3.25 123.38,4.62 124.88,4.62 125.62,5.38 125.62,10.38 126.38,10.38 126.75,10.75 126.75,12.62 127,12.62 B5.LV4
37ECRD_  (via drill 0.35)
  Top 0.3: v69.51,34.87 67.5,36.88 67.5,39.18 v68.62,40.31 | v16,55.5 18.38,55.5 19.38,54.5 J3.26 | v16.99,60.5 17.61,61.12 v23.16,61.12 | v32.69,64.5 33.25,63.94 33.25,60.62 33.75,60.12 v34.56,60.12 | v36.5,60.25 36.62,60.12 38.12,60.12 38.25,60.25 39,60.25 39.25,60 45.75,60 50.38,55.38 65.14,55.38 65.41,55.63 IC7.4
  Bottom 0.3: v69.51,34.87 69.51,31.09 IC11.5 | v68.62,40.31 68.5,40.43 68.5,53.38 66,55.88 65.5,55.88 IC7.4 | v16,55.5 16.12,55.62 16.12,59.63 v16.99,60.5 | v32.69,64.5 32.69,64.62 29.5,64.62 27.62,66.5 27.61,66.48 26.79,66.48 23.16,62.85 v23.16,61.12 | v34.56,60.12 36.5,60.12 v36.5,60.25
37ECRD_HV_SLLC_  (via drill 0.35)
  Top 0.3: v88.25,18.75 88.88,18.75 92,15.62 B1.HV4
  Bottom 0.3: v88.25,18.75 87.66,19.34 84.78,19.34 82,22.12 82,52.75 83.62,54.38 84.12,54.38 J2.26
37ECRD_LV_
  Top 0.3: B1.LV4 103.5,16.83 104.46,16.83 106.05,18.41 U$2.26
37ECWR_  (via drill 0.35)
  Top 0.3: v57.62,33.38 53,33.38 46.38,26.75 39.77,26.75 v39.69,26.67 | v17.46,30.48 v17.46,25.4 | v69.25,42.69 65.23,42.69 61.35,38.81 61.35,38.18 IC11.13 | v23.38,25.54 25.14,27.3 35.56,27.3 v36.2,26.67
  Bottom 0.3: v69.25,42.69 69.38,42.82 69.38,50.38 72.25,53.25 73,53.25 IC7.12 | v23.38,25.54 23.38,22.5 22.75,21.88 17.62,21.88 17.38,22.12 17.38,25.31 v17.46,25.4 | v57.62,33.38 61.25,37 61.25,38 IC11.13 | J3.16 19.38,41.75 18,40.38 18,36.12 17.5,35.62 17.5,34.75 17.38,34.62 17.38,30.57 v17.46,30.48 | v39.69,26.67 v36.2,26.67
37ECWR_HV_SLLC_  (via drill 0.35)
  Top 0.3: v94.1,71.25 118.88,71.25 124.25,65.88 128.38,65.88 128.62,65.62 130.25,65.62 139.88,56 139.88,15.5 137.5,15.5 137.25,15.25 B5.HV3 | J2.16 84.12,41.88 84.09,41.91 79.07,41.91 78.33,42.65 v78.33,49 | v78.42,64.77 v84.77,64.77
  Bottom 0.3: v78.33,49 78.33,61.83 78.42,61.92 v78.42,64.77 | v94.1,71.25 91.25,71.25 90.25,70.25 90.25,67.5 90.11,67.36 90.11,65.03 89.85,64.77 v84.77,64.77
37ECWR_LV_
  Bottom 0.3: U$2.34/A15 122,5.75 123.38,7.12 123.38,8.62 124.88,10.12 124.88,13.5 126.5,15.12 127,15.12 B5.LV3
37EX_
  Top 0.3: IC7.14 70.54,58.42 68.08,60.88 65.5,60.88 IC7.2
  Bottom 0.3: IC6.12 58.38,16.88 56,16.88 56,47.1 63,54.1 63,59.25 64.62,60.88 65.38,60.88 IC7.2
37EX_WR_RD
  Bottom 0.3: IC5.3 43.25,31.5 43.25,47 45.12,48.88 45.62,48.88 IC1.3
37EXRD
  Top 0.3: IC1.4 45.75,46.25 45.75,43.88 IC1.5 45.88,43.88 46.62,43.88 47,43.5 48.5,43.5 48.5,41 53.5,36 66.51,36 71.44,31.07 IC11.6
37EXRD_  (via drill 0.35)
  Top 0.3: v23.5,34.88 25.92,37.3 40.67,37.3 44.62,41.25 45.62,41.25 IC1.6 | IC1.1 45.72,57 43.97,58.75 35.88,58.75 35.3,59.32 35.3,63.31 34.5,64.11 v34.5,64.62
  Bottom 0.3: v23.5,34.88 24.12,34.25 24.12,22.5 21.43,19.81 21.43,19.5 21.5,19.5 IC4.19 | IC1.1 45.75,54 48.12,54 48.12,43 46.5,41.38 45.75,41.38 IC1.6 | v34.5,64.62 34.29,64.83 IC2.19
37EXWR
  Top 0.3: IC1.10 53.38,43.75 53.38,41.38 IC1.9 53.5,41.38 54,41.38 54.5,40.88 61.88,40.88 64.76,43.76 70.95,43.76 73.98,40.73 IC11.8
37EXWR_  (via drill 0.35)
  Top 0.3: v19.42,14.38 46.75,14.38 v54.28,21.91 v54.29,21.91 | v50.5,51.44 45.73,51.44 IC1.2 45.09,51.44 43.62,52.9 43.62,56.12 41.62,58.12 35,58.12 32,61.12 31.75,61.12 IC2.1
  Bottom 0.3: v19.42,14.38 19.12,14.08 19.12,12 19,12 19,11.5 IC4.1 | v50.5,51.44 50.88,51.44 50.88,40.62 53.25,38.25 IC1.8 53.38,38.62 53.38,37.5 54.75,36.12 54.75,22.62 54.29,22.17 v54.29,21.91
A0  (via drill 0.35)
  Top 0.3: v13.5,38.25 13.88,37.88 18,37.88 19.12,36.75 19.38,36.75 J3.12
  Bottom 0.3: U$1.P$25 12.5,42.11 13.05,42.11 13.5,41.66 v13.5,38.25
A0_HV_SLLC  (via drill 0.35)
  Top 0.3: v102.38,18.88 91.38,18.88 89.25,21 79.12,21 79.12,31.62 84.12,36.62 J2.12 | v132.63,30.01 132.38,29.75 128.73,29.75 127.54,28.55 126.46,28.55 125.27,29.75 118.62,29.75 110.62,21.75 107.43,21.75 107.13,22.05 106.23,22.05 105.93,21.75 v103.5,21.75
  Bottom 0.3: v102.38,18.88 103.62,20.12 103.62,21.62 v103.5,21.75 | B5.HV1 137.16,25.48 v132.63,30.01
A0_LV  (via drill 0.35)
  Top 0.3: U$2.36/A17 123.25,12.12 v124.12,12.12 | v124.38,21.5 124.38,22.75 127,25.38 B5.LV1
  Bottom 0.3: v124.12,12.12 124.25,12.25 124.25,21.38 v124.38,21.5
A1  (via drill 0.35)
  Top 0.3: v14.25,42.88 11.5,45.62 U$1.P$27 | v14.12,35.62 15.38,34.38 19.25,34.38 19.38,34.25 J3.10
  Bottom 0.3: v14.25,42.88 14.25,35.75 v14.12,35.62
A1_HV_SLLC  (via drill 0.35)
  Top 0.3: v79.88,29.88 84.12,34.12 J2.10 | v83.61,18.25 83.61,18.57 84.55,19.5 89.25,19.5 91.5,17.25 v102.38,17.25 | v103.5,14.62 105.88,17 107.49,17 108.58,18.1 109.74,18.1 113.93,22.28 114.36,22.28 v114.62,22.54 | B6.HV4 137.12,29.75 136,29.75 133.12,26.88 126,26.88 125.25,26.12 125.25,25.25 122.38,22.38 117.64,22.38 v117.47,22.54
  Bottom 0.3: v79.88,29.88 79.88,20 81.62,18.25 v83.61,18.25 | v102.38,17.25 103.62,16 103.62,14.75 v103.5,14.62 | v117.47,22.54 v114.62,22.54
A1_LV  (via drill 0.35)
  Top 0.3: v126,11.5 125.88,11.5 124.38,13 122.25,13 122,13.25 U$2.37/A18 | v129.22,21.91 v129.22,16.51
  Bottom 0.3: v126,11.5 126.24,11.26 128.51,11.26 129.11,11.86 129.11,16.4 v129.22,16.51 | B6.LV4 127,28.3 129.12,26.17 129.12,22 v129.22,21.91
A2  (via drill 0.35)
  Top 0.3: v34.06,50.6 34.6,50.06 61.93,50.06 64.12,52.25 67.94,52.25 67.94,55.24 68.58,55.88 IC7.13 | v11.38,64.62 11.5,64.5 26.08,64.5 v27.33,65.75
  Bottom 0.3: v34.06,50.6 33.62,51.04 33.62,57.25 33.26,57.62 28.88,57.62 28.88,63.25 27.33,64.8 v27.33,65.75 | v11.38,64.62 10.12,64.62 7.5,62.01 7.5,61 U$1.P$40
A3  (via drill 0.35)
  Top 0.3: v56.38,58.12 65.12,58.12 65.38,58.38 IC7.3 | v15.75,35.12 14,36.88 10.88,36.88 9.12,38.62 9.12,53 7.75,53 7.5,53.25 U$1.P$34 | v44.62,17 44.16,17.46 42.1,17.46 42.01,17.38 20.75,17.38 20.12,18 20.12,20 19.63,20.5 19.38,20.5 19.15,20.72 18.31,20.72 17.84,20.25 v16,20.25 | v15.24,23.5 15.24,25.72 14.61,26.35 14.61,28.26 14.92,28.57 v14.92,28.89
  Bottom 0.3: v56.38,58.12 54.12,55.88 51.62,55.88 51.62,55.5 49.43,53.31 49.43,33.12 50,32.56 50,24.88 50.12,24.75 50.12,22.5 v44.62,17 | v16,20.25 15.24,21.01 v15.24,23.5 | v15.75,35.12 15.75,34.48 14.92,33.66 v14.92,28.89
A5
  Top 0.3: U$1.P$35 11.5,56 12.5,56 13.87,57.37 28.04,57.37 28.89,56.52 IC3.1
A6
  Top 0.3: IC3.2 29.88,54 32,56.12 32,57 31.12,57.88 13.38,57.88 12.62,57.12 10.75,57.12 10.62,57 10.5,57 9.25,58.25 7.62,58.25 7.5,58.38 U$1.P$38
A7  (via drill 0.35)
  Top 0.3: v24.91,51.5 29.75,51.5 IC3.3 | v14.61,61.91 14.61,62.01 14.46,62.15 10.94,62.15 10.38,61.59 v9.53,61.59
  Bottom 0.3: v24.91,51.5 24.75,51.66 24.75,55.69 17.58,62.87 15.56,62.87 v14.61,61.91 | U$1.P$36 7.5,56 7.75,56.25 7.75,57 8.75,58 8.75,58.25 10.48,59.98 10.48,60.23 10.24,60.47 10.24,60.88 v9.53,61.59
A8  (via drill 0.35)
  Top 0.3: v28.83,24.61 27.24,24.61 25.27,22.64 18.99,22.64 18.77,22.86 16.51,22.86 15.9,22.25 15,22.25 11.88,25.38 11.5,25.38 U$1.P$11
  Bottom 0.3: v28.83,24.61 28.83,39.62 29.47,40.26 30.93,40.26 31.52,40.85 31.52,46.77 29.84,48.45 IC3.4
A9  (via drill 0.35)
  Top 0.3: v14.29,65.41 v16.51,65.41 | v8.57,36.83 9.53,35.88 9.53,34.29 10.79,33.02 U$1.P$17
  Bottom 0.3: IC3.5 29.53,46.67 27.3,46.67 26.35,47.62 26.35,53.66 26.04,53.98 26.04,56.2 16.83,65.41 v16.51,65.41 | v14.29,65.41 13.02,64.14 13.02,60.96 13.65,60.96 14.29,60.33 14.29,58.1 12.62,56.44 12.62,52.85 11.85,52.07 10.48,52.07 10,51.6 10,45.04 8.65,43.69 8.65,36.91 v8.57,36.83
A10  (via drill 0.35)
  Top 0.3: U$1.P$4 7.5,15.25 7.5,15.62 10.88,19 12.38,19 15,21.62 16.23,21.62 16.74,22.14 26.33,22.14 v27.12,22.93
  Bottom 0.3: v27.12,22.93 27.12,43 27.94,43.81 IC3.6
A11  (via drill 0.35)
  Top 0.3: v26.99,6.67 v38.1,6.67
  Bottom 0.3: IC6.13 58.38,14.25 58.34,14.29 50.88,14.29 45.59,9 40.43,9 v38.1,6.67 | U$1.P$9 11.5,22.75 12.62,21.62 12.62,17.88 13.38,17.12 13.38,10.48 14.96,8.89 24.77,8.89 v26.99,6.67
A12  (via drill 0.35)
  Top 0.3: U$1.P$5 11.5,17.88 12,17.88 15.12,21 16.63,21 17.18,21.55 27.66,21.55 28.02,21.91 33.34,21.91 34.29,22.86 34.29,26.18 v34.16,26.32
  Bottom 0.3: IC3.11 37.38,48.88 36.38,48.88 36.38,48.5 35,47.12 35,35.12 36.62,33.5 36.62,30.38 34.16,27.91 v34.16,26.32
A13  (via drill 0.35)
  Top 0.3: v33.94,35.91 33.86,35.83 30.82,35.83 v30.5,35.51 | U$1.P$6 7.38,17.75 7.25,17.62 5.88,17.62 5.88,11.12 14.91,11.12 v14.92,11.11 | v24.59,15.76 19.26,15.76 v17.99,14.49
  Bottom 0.3: v30.5,35.51 30.32,35.33 30.32,17.05 29.46,16.19 25.72,16.19 25.29,15.76 v24.59,15.76 | IC3.12 34.5,48.47 34.5,36.47 v33.94,35.91 | v17.99,14.49 14.92,11.42 v14.92,11.11
A14  (via drill 0.35)
  Top 0.3: v27.6,13.31 42.44,13.31 47.18,8.57 v47.31,8.57 | IC6.2 66,9.12 62.12,5.25 50.5,5.25 50.5,5.7 v50.48,5.71
  Bottom 0.3: U$1.P$10 7.5,22.88 7.75,22.88 9,24.12 11.88,24.12 13.38,22.62 13.38,18 14,17.38 14,15.88 14.05,15.83 14.05,14.11 14.82,13.34 15.8,13.34 17.69,15.22 19.93,15.22 19.95,15.24 22.09,13.1 26.77,13.1 26.98,13.31 v27.6,13.31 | v47.31,8.57 50.16,5.71 v50.48,5.71
A15  (via drill 0.35)
  Top 0.3: v9.53,6.67 v9.53,3.49
  Bottom 0.3: U$1.P$7 11.38,20.25 11.12,20.25 9.5,18.62 9.5,6.69 v9.53,6.67 | IC6.3 64.45,11.75 62.87,10.16 62.87,7.87 57.25,2.25 27.43,2.25 26.46,1.28 23.24,1.27 11.75,1.27 v9.53,3.49
D0  (via drill 0.35)
  Top 0.3: v6.17,63.38 6.3,63.25 25.09,63.25 25.2,63.36 26.64,63.36 27.66,64.38 28.38,64.38 31.25,67.25 35.75,67.25 v35.88,67.38 | v37.25,64.62 37.25,64.38 42.5,64.38 44.45,62.42 IC2.6 IC2.7
  Bottom 0.3: v6.17,63.38 5.5,62.7 5.5,49.75 6.88,48.38 7.38,48.38 U$1.P$30 | v35.88,67.38 36.12,67.12 36.12,65.75 v37.25,64.62
D0_HV  (via drill 0.35)
  Top 0.3: v17.99,60.38 24.38,60.38 27.62,63.62 28.38,63.62 31.38,66.62 36.25,66.62 36.5,66.88 44,66.88 46.82,69.7 46.84,69.7 IC2.14 | v16.62,53.48 17.98,53.48 v18.12,53.62
  Bottom 0.3: v17.99,60.38 17.99,60.06 16.75,58.82 16.75,53.6 v16.62,53.48 | v18.12,53.62 18.12,55 19,55.88 20.61,55.88 J3.25 | IC2.13 IC2.14
D0_HV_SLLC
  Top 0.3: J2.25 86.75,54.5 88.38,56.12 88.38,65.5 88.75,65.5 90.38,67.12 90.38,67.75 92.12,69.5 B3.HV4
D0_LV
  Top 0.3: U$2.2 106.75,54 108.25,55.5 108.25,68.75 103.38,68.75 102.62,69.5 102.25,69.5 B3.LV4
D1  (via drill 0.35)
  Top 0.3: v4.24,63.65 4.72,64.12 6.94,64.12 7.19,63.88 26.45,63.88 27.45,64.88 28.13,64.88 31.12,67.88 35.25,67.88 35.5,68.12 36.25,68.12 36.43,67.94 v40.16,67.94 | IC2.4 IC2.5
  Bottom 0.3: v40.16,67.94 39.38,67.15 39.38,62.5 39.5,62.5 IC2.4 | v4.24,63.65 4.24,41.32 U$1.P$22
D1_HV  (via drill 0.35)
  Top 0.3: v35.32,55.1 32.71,52.5 23.62,52.5 23.12,52 22,52 J3.23
  Bottom 0.3: v35.32,55.1 35.32,56.59 36.51,57.78 39.3,57.78 40.9,59.38 40.9,63.31 41.91,64.32 IC2.16 IC2.15
D1_HV_SLLC
  Top 0.3: J2.23 86.75,52 88.86,54.12 91.74,54.12 93.88,56.25 93.88,66.88 92.12,66.88 B3.HV3
D1_LV
  Top 0.3: U$2.3/CANTX 106.62,51.5 103,55.12 102,55.12 100.88,56.25 100.88,57.25 100.75,57.25 100,58 100,66.75 102,66.75 102.12,66.88 B3.LV3
D2  (via drill 0.35)
  Top 0.3: v25.5,62.62 25.38,62.75 7.53,62.75 7.41,62.62 7.12,62.62 5.71,61.22 5.71,57.41 6.79,57.41 6.97,57.23 7.86,57.23 8.26,56.83 v8.89,56.83 | v26.67,61.59 28.14,61.59 31.91,65.38 47.97,65.38 49.59,63.75 49.59,62.5 49.5,62.5 IC2.8 50,62.5 52,62.5 IC2.9
  Bottom 0.3: U$1.P$32 7.38,50.88 8.79,52.29 8.79,56.73 v8.89,56.83 | v25.5,62.62 25.72,62.41 25.72,61.59 v26.67,61.59
D2_HV  (via drill 0.35)
  Top 0.3: J3.21 22,49.5 23.12,49.5 23.62,50 32.08,50 34.7,52.62 41.97,52.62 v42.56,52.04
  Bottom 0.3: 51.62,69 51.62,68.75 48.5,65.62 48.5,60.62 42.56,54.68 v42.56,52.04 | 51.62,69 51.62,69.38 52,69.75 54.51,69.75 IC2.11 | IC2.12 52,69.5 51.5,69 51.62,69
D2_HV_SLLC  (via drill 0.35)
  Top 0.3: v89.12,56.25 92.12,59.25 B3.HV2
  Bottom 0.3: v89.12,56.25 89.12,51.88 86.75,49.5 J2.21
D2_LV  (via drill 0.35)
  Top 0.3: v104.88,56.5 102.12,59.25 B3.LV2
  Bottom 0.3: v104.88,56.5 104.88,50.75 106.62,49 U$2.4/CANRX
D3  (via drill 0.35)
  Top 0.3: v31.93,59.62 31.91,59.64 16.81,59.64 16.51,59.94 13.2,59.94 v13.33,60.07
  Bottom 0.3: U$1.P$26 7.5,43.25 9.5,45.25 9.5,56.41 9.62,56.53 9.62,57.13 9.5,57.26 9.5,58.25 11,59.75 13.01,59.75 v13.33,60.07 | v31.93,59.62 32.25,59.62 34.06,61.44 | 34.06,61.44 34.25,61.62 34.25,62.12 34.35,62.23 IC2.3 | IC2.2 34,62 34,61.5 34.06,61.44
D3_HV  (via drill 0.35)
  Top 0.3: v36.88,66.12 36.75,66 31.5,66 28.38,62.88 v28.12,62.88 | v28,48.25 26.38,46.62 22.12,46.62 22,46.75 J3.19
  Bottom 0.3: v36.88,66.12 36.88,69.5 37,69.5 IC2.18 IC2.17 | v28.12,62.88 28.12,58 27.38,57.25 27.38,54.62 27.88,54.12 27.88,48.38 v28,48.25
D3_HV_SLLC  (via drill 0.35)
  Top 0.3: v90,55.5 91.25,56.75 92,56.75 B3.HV1
  Bottom 0.3: v90,55.5 89.63,55.13 89.63,51.67 88.04,50.08 88.04,48.23 J2.19
D3_LV  (via drill 0.35)
  Top 0.3: v103.88,55.38 102.5,56.75 102.25,56.75 B3.LV1
  Bottom 0.3: v103.88,55.38 104.25,55 104.25,50.5 104.88,49.88 104.88,48.12 106.62,46.38 U$2.5
D4
  Top 0.3: U$1.P$18 7.38,33 5.25,30.88 5.25,9.38 19.5,9.38 21.5,11.38 21.5,11.5 IC4.2
  Bottom 0.3: IC4.3 IC4.2
D4_HV  (via drill 0.35)
  Top 0.3: v25.74,25.19 24.88,24.33 v24.88,23.38 | IC4.18 IC4.17
  Bottom 0.3: v24.88,23.38 24.88,22.08 25.98,20.98 26,21 26.5,20.5 26.5,19.5 IC4.17 | v25.74,25.19 25.74,25.7 25.4,26.04 25.4,34.92 23.29,37.03 23.29,42.32 22,43.61 J3.17
D4_HV_SLLC
  Top 0.3: J2.17 86.75,44.38 88.99,46.62 88.99,51.25 91.88,51.25 92,51.38 B4.HV4
D4_LV
  Bottom 0.3: U$2.6 106.62,43.88 104.25,46.25 104.25,49.75 102.62,51.38 102.25,51.38 B4.LV4
D5  (via drill 0.35)
  Top 0.3: U$1.P$28 4.93,45.72 4,44.79 4,8.12 19.75,8.12 20.38,8.75 33.8,8.75 v34.29,8.26
  Bottom 0.3: v34.29,8.26 36.51,10.48 IC4.8 IC4.9
D5_HV  (via drill 0.35)
  Top 0.3: v35.75,38.68 34.68,39.75 24.38,39.75 22.38,41.75 22,41.75 J3.15 | v43.5,20 45.09,20 47.25,22.16 47.25,24.89 47.94,25.59 v47.94,26.67 | IC4.12 IC4.11
  Bottom 0.3: v35.75,38.68 35.75,36 35.74,35.99 35.74,35.1 37.73,33.11 38.52,33.11 39.11,32.51 39.11,30.86 40.22,29.76 41.04,29.76 44.13,26.67 v47.94,26.67 | v43.5,20 42.55,20 IC4.11
D5_HV_SLLC
  Top 0.3: J2.15 86.75,41.88 90.25,45.38 90.25,48.75 91.88,48.75 92,48.88 B4.HV3
D5_LV
  Top 0.3: U$2.7 106.62,41.38 104,44 104,48.75 102.38,48.75 102.25,48.88 B4.LV3
D6
  Top 0.3: U$1.P$24 7.38,40.62 4.62,37.88 4.62,8.75 19.62,8.75 20.25,9.38 29.62,9.38 31.62,11.38 31.5,11.38 31.5,11.5 IC4.6
  Bottom 0.3: IC4.7 IC4.6
D6_HV  (via drill 0.35)
  Top 0.3: v31.89,39 22.12,39 22,39.12 J3.13 | IC4.13 IC4.14
  Bottom 0.3: v31.89,39 31.89,38.05 32.2,37.73 32.2,34.11 31.57,33.47 31.57,22.06 33.5,20.12 33.5,19.52 IC4.14
D6_HV_SLLC
  Top 0.3: J2.13 86.75,39.25 88.75,41.25 92,41.25 B4.HV2
D6_LV
  Top 0.3: U$2.8 106.62,38.75 104,41.38 102.25,41.38 B4.LV2
D7  (via drill 0.35)
  Top 0.3: v14.38,19.12 14.75,18.75 16,18.75 17.12,17.62 17.12,13.5 24.38,13.5 25.94,11.94 26,12 26,11.5 IC4.4
  Bottom 0.3: U$1.P$20 7.46,34.9 9.19,33.17 9.19,31.81 9.5,31.5 9.5,30.5 10.87,29.13 11.92,29.13 12.62,28.43 12.62,24.09 13.88,22.83 13.88,19.62 v14.38,19.12 | IC4.4 IC4.5
D7_HV
  Top 0.3: IC4.16 IC4.15
  Bottom 0.3: J3.11 22,36.62 22.88,36.62 24.75,34.75 24.75,24.8 25.62,23.92 25.62,22.38 28.5,19.5 IC4.16
D7_HV_SLLC
  Top 0.3: J2.11 86.75,36.75 88.5,38.5 91.88,38.5 92,38.62 B4.HV1
D7_LV
  Top 0.3: U$2.9/CS 104.38,38.5 103.12,38.5 103,38.62 102.25,38.62 B4.LV1
FLIPFLOP_CLR
  Top 0.3: IC5.1 48.25,31.38 48.25,30.33 45.86,27.94 43.03,27.94 42.72,28.26 24.76,28.26 23.12,26.62 22,26.62 J3.3
FLIPFLOP_CLR_HV_SLLC
  Top 0.3: J2.3 86.75,26.5 88.88,24.38 89.03,24.38 89.48,23.93 89.48,23.12 88.9,22.54 88.9,21.91 89.3,21.5 89.46,21.5 90.32,20.64 B2.HV1
FLIPFLOP_CLR_LV
  Top 0.3: U$2.25 106.62,20.88 103.12,20.88 103,20.75 102.25,20.75 B2.LV1
FLIPFLOP_PRE  (via drill 0.35)
  Top 0.3: v38.21,39.5 36.62,39.5 30.88,45.25 v25.84,45.25
  Bottom 0.3: v38.21,39.5 38.21,36.75 40.25,34.71 40.25,31.88 40.62,31.5 IC5.4 | v25.84,45.25 24.89,45.25 23.29,46.85 23.29,55.02 21.93,56.38 18.79,56.38 17.38,54.96 17.38,48.12 18.62,46.88 19.38,46.88 J3.20
FLIPFLOP_PRE_HV  (via drill 0.35)
  Top 0.3: v80.62,45.63 81.61,46.62 84,46.62 84.12,46.75 J2.20 | B1.HV1 92,2.88 90.62,4.25 90.62,6.12 87.62,9.12 83.33,9.12 78.42,14.04 78.42,15.56 81.18,18.32 v81.18,19.82
  Bottom 0.3: v80.62,45.63 80.62,20.65 81.18,20.09 v81.18,19.82
FLIPFLOP_PRE_LV
  Bottom 0.3: U$2.29 106.62,10.75 104.25,8.38 104.25,4.5 102.62,2.88 102.25,2.88 B1.LV1
GND
  pour Top: 0,73.98 0.31,-0.32 142.24,0.56 142.24,73.1
INTERUPT_TO_TRS80_
  Top 0.3: J3.14 19.38,39.25 16.25,39.25 R7.2 16.12,39.25 12.62,39.25 11.5,38.12 U$1.P$21
INTERUPT_TO_TRS80_HV_SLLC_  (via drill 0.35)
  Top 0.3: J2.14 v79.88,39.25 v79.88,39.26 | v88.38,52.5 89,53.12 99.5,53.12 99.75,52.88 103.25,52.88 106.12,50 107.38,50 108.75,51.38 112.84,51.38 118.97,45.25 123.8,45.25 123.97,45.07 129.23,45.07 130.16,44.13 v130.81,44.13
  Bottom 0.3: v88.38,52.5 88.42,52.55 87.96,53.01 87.96,55.02 87.2,55.77 83.29,55.77 82.83,55.31 82.83,54.29 81.5,52.96 81.5,50.7 80.52,49.72 80.52,49.07 80.87,48.72 80.87,46.92 79.89,45.94 79.89,39.28 v79.88,39.26 | B5.HV2 137.12,22.88 136.75,22.88 130.84,28.79 130.84,44.1 v130.81,44.13
INTERUPT_TO_TRS80_LV_  (via drill 0.35)
  Top 0.3: v123.5,19.5 126.75,22.75 127,22.75 B5.LV2
  Bottom 0.3: v123.5,19.5 123.62,19.38 123.62,12.75 123.38,12.5 123.38,11.75 123.51,11.62 123.51,10.16 121.92,8.57 U$2.35/A16
N$1
  Top 0.3: U$2.AREF 119.5,54 122,56.5 U$2.3V3_LO
N$5  (via drill 0.35)
  Top 0.3: v123.88,61 123.88,54.25 122.62,54.25 122.25,53.88 122,53.88 U$2.23/A9
  Bottom 0.3: v123.88,61 123.88,62.38 123,63.25 123,69 122.88,69.12 R1.1
N$6
  Top 0.3: R2.1 124.88,64.75 124.88,51.75 122.25,51.75 122,51.5 U$2.22/A8
N$9
  Top 0.3: R3.1 127,64.12 125.41,62.54 125.41,51.44 122.87,48.9 U$2.21/A7
N$10
  Bottom 0.3: R1.2 125.5,69.12 127.62,69.12 RGB_LED1.1
N$14
  Top 0.3: R2.2 124.88,67.25 129.12,67.25 RGB_LED1.2
N$15
  Bottom 0.3: R3.2 129.62,64.25 132,66.62 132,67.25 RGB_LED1.4
N$16  (via drill 0.35)
  Top 0.3: v131.76,25.72 v131.76,14.29
  Bottom 0.3: R4.1 124.5,8.38 126.43,10.31 128.31,10.31 131.76,13.76 v131.76,14.29 | U$2.20/A6 122.51,46.5 124.24,44.77 127.53,44.77 arc-90 129.43,42.86 129.43,28.05 v131.76,25.72
N$17  (via drill 0.35)
  Top 0.3: v118.25,16.75 118.25,10.38 121.5,7.12 123,7.12 124.38,5.75 R5.1
  Bottom 0.3: v118.25,16.75 118.62,17.12 118.62,40.62 121.88,43.88 U$2.19/A5/SCL
N$18  (via drill 0.35)
  Top 0.3: v116.2,10.16 116.2,9.84 v119.06,6.99
  Bottom 0.3: R6.1 124.38,3.25 123,4.62 120.02,4.62 119.06,5.58 v119.06,6.99 | U$2.18/A4/SDA 121.88,41.25 119.25,38.62 119.25,17.62 120.5,16.38 120.5,14.5 116.2,10.21 v116.2,10.16
N$19
  Top 0.3: R4.2 127,8.38 129.12,10.5 131.75,10.5 RGB_LED2.1
N$20
  Top 0.3: R5.2 127,5.75 129.75,8.5 129.75,8.88 RGB_LED2.2
N$21
  Top 0.3: R6.2 127,3.25 129.75,6 RGB_LED2.4
NOTHING1_HV_SLLC  (via drill 0.35)
  Top 0.3: v88.75,23.62 87.38,22.25 82.38,22.25 82.38,27.25 84.12,29 J2.6 | v90.12,33.88 91.25,35 113.5,35 120.88,42.38 122.62,42.38 124.18,43.93 128.38,43.93 132.19,40.12 137.12,40.12 B6.HV2
  Bottom 0.3: v88.75,23.62 90,24.88 90,33.75 v90.12,33.88
NOTHING1_LV  (via drill 0.35)
  Top 0.3: v120,36.38 121.25,37.62 123.5,37.62 126,40.12 127,40.12 B6.LV2
  Bottom 0.3: v120,36.38 120,17.75 121.88,15.88 U$2.38/A19
NOTHING2_HV_SLLC  (via drill 0.35)
  Top 0.3: v120.25,47 121,47.75 123.5,47.75 127.5,51.75 129.12,51.75 130.69,50.18 130.69,46.16 134.3,42.55 B6.HV1 | v105.25,36.38 100.51,36.38 v100.33,36.2
  Bottom 0.3: v105.25,36.38 106.5,37.62 107.25,37.62 107.25,37.75 116.5,47 v120.25,47 | v100.33,36.2 97.47,33.34 97.47,19.05 96.2,17.78 90.25,17.78 88.19,19.85 84.99,19.85 82.5,22.33 82.5,24.92 J2.4
NOTHING2_LV
  Bottom 0.3: U$2.39/A20 122,18.5 122.75,19.25 122.75,19.88 123.62,20.75 123.62,22.88 124.25,23.5 124.25,40.12 126.62,42.5 127,42.5 B6.LV1
NOTHING3_HV_SLLC  (via drill 0.35)
  Top 0.3: v88,21.75 87.88,21.62 81.75,21.62 81.75,29.12 84.12,31.5 J2.8 | v88.88,20.25 89,20.12 89.38,20.12 91.38,18.12 104.25,18.12 105.88,19.75 110.01,19.75 114.89,24.62 123.91,24.62 124.75,25.46 124.75,26.33 125.91,27.5 132.2,27.5 137.14,32.44 B6.HV3
  Bottom 0.3: v88,21.75 88.88,20.88 v88.88,20.25
NOTHING3_LV  (via drill 0.35)
  Top 0.3: v112.88,26.39 112.88,26.71 118.66,32.5 127,32.5 B6.LV3
  Bottom 0.3: v112.88,26.39 112.88,15.56 112.85,15.53 112.85,14.15 106.95,8.26 U$2.30
RAS_  (via drill 0.35)
  Top 0.3: v11.9,5.47 15.71,5.47 19.81,1.38 24,1.38 24.5,1.88 61.25,1.88 66,6.62 IC6.1
  Bottom 0.3: v11.9,5.47 11.5,5.87 11.5,12.62 U$1.P$1
RD
  Bottom 0.3: IC7.1 64.75,63.5 61.74,60.49 61.74,54.87 55.38,48.5 55.38,48.38 53.38,46.38 IC1.11
RD_  (via drill 0.35)
  Top 0.3: v16.23,61.18 16.92,61.88 v24.75,61.88 | v14.61,50.8 v14.61,46.99 | v25.61,60.38 v30.38,60.38 | IC1.13 52.81,51.44 44.87,59.37 38.75,59.37 v38.62,59.5
  Bottom 0.3: IC1.12 53.38,49 53.38,51.38 IC1.13 | v25.61,60.38 24.75,61.24 v24.75,61.88 | v38.62,59.5 35.38,59.5 34.75,58.88 30.66,58.88 30.16,59.37 30.16,60.16 v30.38,60.38 | U$1.P$15 11.38,30.5 9.82,32.06 9.82,43.32 10.88,44.38 11.96,44.38 14.57,46.99 v14.61,46.99 | v16.23,61.18 15.62,60.57 15.62,56.16 15.27,55.8 15.27,51.46 v14.61,50.8
VCC
  Bottom 0.3: C1.2 15.88,15.24 16.53,15.89 18.18,15.89 18.61,16.32 18.61,18.92 IC4.20
  pour Bottom: 0,73.66 142.03,73.66 142.35,0 0,0
VCC/2  (via drill 0.35)
  Top 0.3: U$2.3V3_2 111.88,15.88 113.5,17.5 120.75,17.5 121.25,17 122.62,17 125.88,20.25 127,20.25 B5.LV | v100.12,54.26 v100.12,56.38
  Bottom 0.3: B6.LV 125.5,37.47 124.88,36.84 124.88,22.12 126.62,20.38 127,20.38 B5.LV | 104.25,24.12 104.25,12.12 | 104.25,12.12 104.25,9.75 103,8.5 103,8 102.25,8 B1.LV | 104.25,24.12 102.75,25.62 102.25,25.62 B2.LV | 104.25,24.12 104.25,41.75 102.25,43.75 B4.LV 102.12,43.88 101.88,43.88 100.12,45.62 v100.12,54.26 | v100.12,56.38 100.12,60.12 101.5,61.5 101.5,61.88 102.12,61.88 B3.LV | U$2.3V3_2 111.76,14.93 108.95,12.12 104.25,12.12
WAIT_  (via drill 0.35)
  Top 0.3: v32.88,54.97 32.88,56.88 31.12,58.62 v13.5,58.62
  Bottom 0.3: v32.88,54.97 32.88,53.06 33.02,52.92 33.02,35.8 35.24,33.58 35.24,31.75 IC5.6 | U$1.P$33 11.43,54.2 10.24,55.39 10.24,56.37 10.94,57.07 11.95,57.07 v13.5,58.62
WR_  (via drill 0.35)
  Top 0.3: v25.61,71.32 26.36,72.07 56.01,72.07 62.78,65.3 68.7,65.3 73,61 IC7.15 | v7.62,68.9 v17.14,68.9
  Bottom 0.3: v17.14,68.9 18.47,67.57 18.47,67.54 20.54,65.47 23.46,65.47 25.53,67.54 25.53,71.23 v25.61,71.32 | v7.62,68.9 6.06,68.9 2.54,65.38 2.54,36.26 6.97,31.83 8.46,31.83 9,31.29 9,30.29 11.35,27.94 U$1.P$13
XX11X111111XXXX  (via drill 0.35)
  Top 0.3: v54.12,16 58.38,11.75 IC6.14 | v52.62,35.62 52.62,36 47.88,40.75 47.88,42.38 39.25,42.38 38.25,41.38 37.5,41.38 IC3.8
  Bottom 0.3: v54.12,16 54.12,16.68 52.7,18.1 52.7,24.67 53.41,25.38 53.41,31.28 53.02,31.67 53.02,35.23 v52.62,35.62

### Text on the board
tNames: TRS-80 / SS Drive / V3.0